# Altium schematic sheet Battery_Guage.SchDoc
size B; SheetNumber: 1; SheetTotal: 1
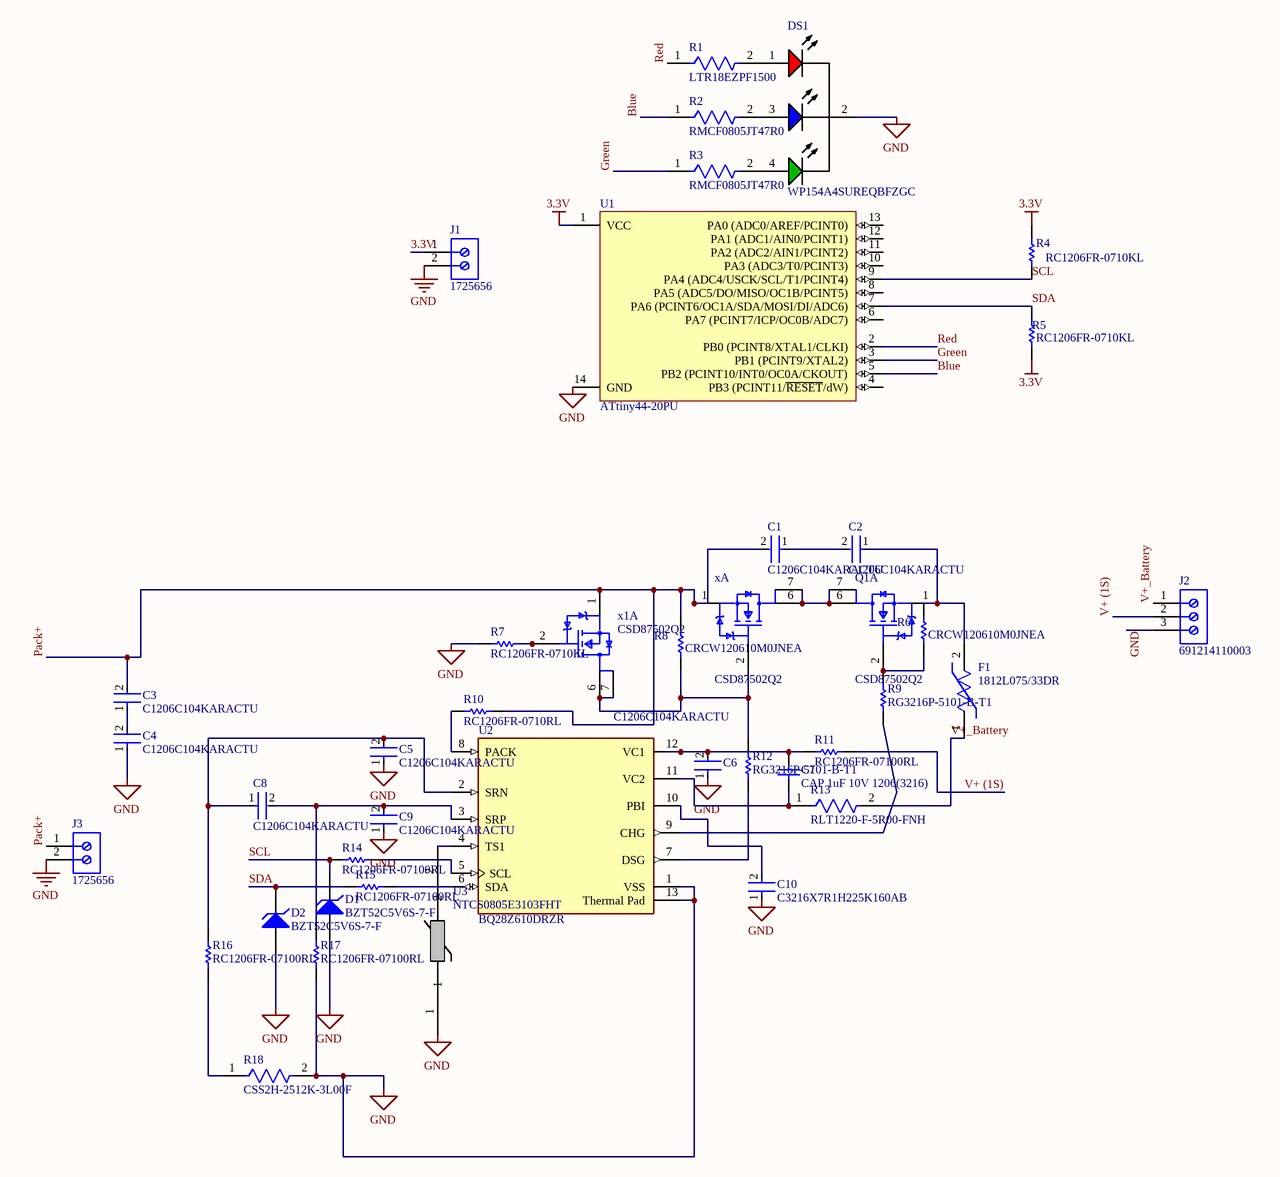
[diagram p0: Battery_Guage.SchDoc]

## Parts
C1  C1206C104KARACTU  [FP-C1206C-EB-MFG]
C2  C1206C104KARACTU  [FP-C1206C-EB-MFG]
C3  C1206C104KARACTU  [FP-C1206C-EB-MFG]
C4  C1206C104KARACTU  [FP-C1206C-EB-MFG]
C5  C1206C104KARACTU  [FP-C1206C-EB-MFG]
C6  C1206C104KARACTU  [FP-C1206C-EB-MFG]
C7  CAP 1uF 10V 1206(3216)  [CAPC1206(3216)130_L]
C8  C1206C104KARACTU  [FP-C1206C-EB-MFG]
C9  C1206C104KARACTU  [FP-C1206C-EB-MFG]
C10  C3216X7R1H225K160AB  [FP-C3216-160-0_2-IPC_A]
D1  BZT52C5V6S-7-F  [DIOD-SOD323-2_V]
D2  BZT52C5V6S-7-F  [DIOD-SOD323-2_V]
DS1  WP154A4SUREQBFZGC  [KING-WP154A4SUREQBFZGC_V]
F1  1812L075/33DR  [FP-1812L075-33DR-MFG]
J1  1725656  [PHOE-1725656-2]
J2  691214110003  [691214110003]
J3  1725656  [PHOE-1725656-2]
Q1  CSD87502Q2  [FP-DQK0006B-MFG]  (part A of 2)
R1  LTR18EZPF1500  [FP-LTR18-IPC_A]
R2  RMCF0805JT47R0  [FP-RMCF0805-MFG]
R3  RMCF0805JT47R0  [FP-RMCF0805-MFG]
R4  RC1206FR-0710KL  [RESC3116X65X40ML10T20]
R5  RC1206FR-0710KL  [RESC3116X65X40ML10T20]
R6  CRCW120610M0JNEA  [RESC3216X60X45LL10T20]
R7  RC1206FR-0710KL  [RESC3116X65X40ML10T20]
R8  CRCW120610M0JNEA  [RESC3216X60X45LL10T20]
R9  RG3216P-5101-B-T1  [RESC3216X50X50NL20T25]
R10  RC1206FR-0710RL  [RESC3116X65X40ML10T20]
R11  RC1206FR-07100RL  [RESC3116X65X40ML10T20]
R12  RG3216P-5101-B-T1  [RESC3216X50X50NL20T25]
R13  RLT1220-F-5R00-FNH  [FP-RLT1220-F-MFG]
R14  RC1206FR-07100RL  [RESC3116X65X40ML10T20]
R15  RC1206FR-07100RL  [RESC3116X65X40ML10T20]
R16  RC1206FR-07100RL  [RESC3116X65X40ML10T20]
R17  RC1206FR-07100RL  [RESC3116X65X40ML10T20]
R18  CSS2H-2512K-3L00F  [FP-CSS2H-2512K-3L00F-MFG]
U1  ATtiny44-20PU  [14P3]
U2  BQ28Z610DRZR  [FP-DRZ0012A-MFG]
U3  NTCS0805E3103FHT  [NTCS0805_VIS]
x  CSD87502Q2  [FP-DQK0006B-MFG]  (part A of 2)
x1  CSD87502Q2  [FP-DQK0006B-MFG]  (part A of 2)

## Nets
3.3V: J1.1 R4.2 R5.1 U1.1(VCC)
GND: C4.1 C5.1 C6.1 C9.1 C10.1 D1.1(A) D2.1(A) DS1.2(CATHODE) J1.2 J2.3 J3.2 R7.1 R17.1 R18.2 U1.14(GND) U2.1(VSS) U2.13(Thermal_Pad) U3.1
Blue: R2.1 U1.5(PB2_(PCINT10/INT0/OC0A/CKOUT))
Green: R3.1 U1.3(PB1_(PCINT9/XTAL2))
Pack+: C1.2 C3.2 J3.1 R8.2 R10.2 x.1(S1) x1.1(S1)
Red: R1.1 U1.2(PB0_(PCINT8/XTAL1/CLKI))
SCL: D1.2(K) R4.1 R14.1 U1.9(PA4_(ADC4/USCK/SCL/T1/PCINT4))
SDA: D2.2(K) R5.2 R15.1 U1.7(PA6_(PCINT6/OC1A/SDA/MOSI/DI/ADC6))
V+ (1S): J2.2 R11.1
V+_Battery: F1.1 J2.1 R13.2
NetC1_1: C1.1 C2.2
NetC2_1: C2.1 F1.2 Q1.1(S1) R6.2
NetC3_1: C3.1 C4.2
NetC5_2: C5.2 C8.1 R16.2 U2.2(SRN)
NetC6_2: C6.2 C7.2 R11.2 U2.12(VC1)
NetC7_1: C7.1 R13.1 U2.11(VC2)
NetC8_2: C8.2 C9.2 R17.2 U2.3(SRP)
NetC10_2: C10.2 U2.10(PBI)
NetDS1_1: DS1.1(RED) R1.2
NetDS1_3: DS1.3(BLUE) R2.2
NetDS1_4: DS1.4(GREEN) R3.2
NetQ1_2: Q1.2(G1) R6.1 R9.2
NetQ1_6: Q1.6(D1) Q1.7(D1) x.6(D1) x.7(D1)
NetR7_2: R7.2 x1.2(G1)
NetR8_1: R8.1 R12.2 x.2(G1) x1.6(D1) x1.7(D1)
NetR9_1: R9.1 U2.9(CHG)
NetR10_1: R10.1 U2.8(PACK)
NetR12_1: R12.1 U2.7(DSG)
NetR14_2: R14.2 U2.5(SCL)
NetR15_2: R15.2 U2.6(SDA)
NetR16_1: R16.1 R18.1
NetU2_4: U2.4(TS1) U3.2

Not connected (* = marked no-connect by the designer): U1 4(PB3_(PCINT11/~{RESET}/dW)) 6(PA7_(PCINT7/ICP/OC0B/ADC7)) 8(PA5_(ADC5/DO/MISO/OC1B/PCINT5)) 10(PA3_(ADC3/T0/PCINT3)) 11(PA2_(ADC2/AIN1/PCINT2)) 12(PA1_(ADC1/AIN0/PCINT1)) 13(PA0_(ADC0/AREF/PCINT0))

## Library data of the parts
C1-C6 C8 C9 = CMP-1037-04229-2: CAP CER 0.1UF 250V X7R 1206; Manufacturer: KEMET; Material: Ceramic; Temperature Coefficient: 15%; Value: 0.10 μF; Tolerance: 0.1; Automotive Grade: Grade 0; Mouser Description: Multilayer Ceramic Capacitors MLCC - SMD/SMT 250volts 0.1uF X7R 10%; Height: 0.88mm; Device Class L3: Ceramic Capacitors; Temperature Range Low: -55°C; Automotive: Yes; ComponentLink2Description: Datasheet; Category: Cap; RoHS: TRUE; Manufacturer Part Number: C1206C104KARACTU; Temperature Range High: +150°C; Package: C1206C-EB; Device Class L2: Capacitors; Voltage Rating: 250 V; Lead Free: Yes; Temperature Characteristic: X7R; Digikey Description: CAP CER 0.1UF 250V X7R 1206; ComponentLink2URL: https://content.kemet.com/datasheets/KEM_C1007_X8R_ULTRA_150C_SMD.pdf; Device Class L1: Passive Components; Ipc Land Pattern Name: CAPC320160X78; Temperature: -55°C to +150°C; Capacitance: 0.10 μF; Octopart: https://octopart.com/c1206c104karactu-kemet-193627
C7 = CMP-1037-04676-1: CAP 1uF 10V ±20% 1206 (3216 Metric) Thickness 1.3mm SMD; Tolerance: Â±20%; Case-Metric: 3216; Case-EIA: 1206; Value: 1uF; Technology: SMT; Rated Voltage: 10 V; Max Thickness: 1.3 mm
C10 = CMP-08246-002981-1: Multilayer Ceramic Capacitors 2.2uF ±10% 50V X7R SMD 1206; Case Code (Metric): 3216; Construction: Flat; Case/Package: 1206; Thickness: 0.075inch; Lead Free: Lead Free; Weight: 0.000571oz; Case Code (Imperial): 1206; Length: 3.2mm; Voltage Rating (DC): 50V; Termination: SMD/SMT; Width: 0.063inch; Packaging: Tape and Reel; Min Operating Temperature: -55°C; Mount: Surface Mount; Dielectric: X7R; RoHS Compliant: Yes; Capacitance: 2.2uF; Voltage Rating: 50V; Resistor Type: Ceramic; Tolerance: 10%; Series: C; Package Quantity: 1; Number of Pins: 2; Height: 1.6mm; Dielectric Material: Ceramic; Max Operating Temperature: 125°C; Depth: 1.6mm
D1 D2 = CMP-2000-05977-1: Surface Mount Zener Diode, 5.6 V, -65 to 150 degC, 2-Pin SOD323, RoHS, Tape and Reel; Manufacturer: DiodesIncorporated; Zener Current: 5mA; Vz - Zener Voltage: 5.6V; Pd - Power Dissipation: 200mW; Configuration: Single; Zz - Zener Impedance: 40Ohms; Ir - Reverse Current: 3uA; Unit Weight: 0.000173oz; Voltage Temperature Coefficient: 0.25mV/C; Voltage Tolerance: 5%; Datasheet Version: Rev. 18-2, 05/2012; Package Reference: SOD323-2; Minimum Operating Temperature: -65C; Packaging: Reel; Product Category: ZenerDiodes; Termination Style: SMD/SMT; Manufacturer URL: http://www.diodes.com/; Height: 1mm; Mounting Style: SMD/SMT; RoHS: True; Package / Case: SOD-323; Package Description: 2-Pin Surface Mount Device, Body 1.7 x 1.3 mm; Width: 1.4mm; Factory Pack Quantity: 3000; Brand: DiodesIncorporated; Mounting Technology: SurfaceMount; Maximum Operating Temperature: +150C; Length: 1.8mm; Package URL: http://www.vishay.com/docs/71192/71192.pdf; Datasheet URL: http://www.diodes.com/_files/datasheets/ds30093.pdf; Series: BZT52C5V6
DS1 = CMP-2000-07415-1: Full Color LED Lamp, Dominant Wavelength RGB 630 / 525 / 465 nm, -40 to 85 degC, 4-Pin THD, RoHS; Manufacturer: Kingbright; Viewing Angle: 50°; Wavelength - Dominant: 630nm,525nm,465nm; Online Catalog: 5mm,T-13/4(RGB)RoundwithDomedTopLEDLamp; Millicandela Rating: 1300mcdRed,1700mcdGreen,900mcdBlue; Other Names: 754-1615 / WP154A4SUREQBFZGC-ND; Current - Test: 20mA; Wavelength - Peak: 645nm,515nm,460nm; Color: Red,Green,Blue(RGB); Voltage - Forward (Vf) (Typ): 1.9VRed,3.3VGreen,3.3VBlue; Lens Type: Clear; 3D Model: WP154A4SUREQBFZGW.sldprt / WP154A4SUREQBFZGW.pro / WP154A4SUREQBFZGW.igs / WP154A4SUREQBFZGW.stp; Lens Style/Size: RoundwithDomedTop,5mm,T-13/4; Packaging: Bulk; Datasheet URL: https://www.kingbrightusa.com/images/catalog/spec/WP154A4SUREQBFZGC.pdf; Family: LEDIndication-Discrete; Datasheet Version: Rev. 5A, 08/2014; Category: Optoelectronics; Manufacturer URL: http://www.kingbright.com/; Height: 8.60mm; Mounting Type: ThroughHole; Package Reference: WP154A4SUREQBFZGC; Mounting Technology: ThroughHole; Package Description: 4-Pin Through Hole LED, Dia 5.9 mm, Pitch 1.27 mm; Standard Package: 500; Package / Case: Radial-4Leads
F1 = CMP-08606-000075-1: PTC RESET FUSE 33V 750MA 1812; Power Dissipation: 800mW; Time to Trip: 200ms; Approvals: TUV; Max Current Rating: 20A; Trip Current: 1.5A; Resistance: 400mR; Working Voltage: 33V; Min Operating Temperature: -40°C; Terminal Material: Copper; Case/Package: 1812; Case Code (Imperial): 1812; Termination: SMD/SMT; Lead Free: Lead Free; Mount: Surface Mount; Case Code (Metric): 4532; Package Quantity: 1500; Packaging: Tape and Reel; Voltage Rating: 33V; Operating Supply Voltage: 33V; Hold Current: 750mA; Height: 1.55mm; Width: 3.41mm; Series: 1812L; Length: 4.73mm; Max Power Dissipation: 800mW; Current Rating: 20A; Max Operating Temperature: 85°C; REACH SVHC: No SVHC; RoHS Compliant: Yes; Voltage Rating (DC): 33V
J1 J3 = CMP-2000-05299-1: Male Header, Pitch 2.54 mm, 1 x 2 Position, Height 9 mm, Tail Length 3.5 mm; Manufacturer: Phoenix Contact; Number of contacts: 2; Content: 250pc(s); Pitch: 2.54mm; Industrial packaging: Yes; Colour: Green; Manufacturer part No.: 1725656; Type: MPT0,5/2-2,54; Datasheet URL: http://datasheet.octopart.com/1725656-Phoenix-Contact-datasheet-5302866.pdf; Manufacturer URL: http://www.phoenixcontact.com/; Datasheet Version: Apr-08
J2 = CMP-1502-02466-2: NexarPartId: 18818289; Number of Levels: 1; Voltage: 300V; Pitch: 3.5052mm; Stripping Length: -6mm; Number of Positions Per Level: 3; Plating: Brass, Steel; Wire/Cable Gauge: 24AWG; Wire Gauge (Min): 16AWG; Current Rating: 10A; Width: 10.9mm; Length: 7.4mm; Housing Material: Nylon; Height: 12.2mm; Min Operating Temperature: -40°C; Contact Plating: Brass, Tin; Packaging: Box; Color: Blue, Green; Number of Contacts: 3; Number of Pins: 3; Voltage Rating: 300V; Termination: Screw; Lead Pitch: 3.5mm; Max Operating Temperature: 105°C; Mount: Through Hole; Contact Material: Brass; RoHS: Compliant; Wire Gauge (Max): 24AWG; Current: 10A; REACH SVHC: Unknown
Q1 x x1 = CMP-04962-000076-1: MOSFET 2N-CH 30V 5A 6WSON; Input Capacitance: 353pF; Max Power Dissipation: 2.3W; Rds On Max: 32.4mR; FET Type: 2 N-Channel; Element Configuration: Dual; Min Operating Temperature: -55°C; Lead Free: Lead Free; Max Operating Temperature: 150°C; Continuous Drain Current (ID): 5A; Packaging: Tape and Reel; Mount: Surface Mount; RoHS Compliant: Yes; Drain to Source Voltage (Vdss): 30V
R1 = CMP-08839-001220-1: High power chip resistors wide terminal type 150Ω 1% 0.75W 0612; Temperature Coefficient: 100ppm/°C; Max Power Dissipation: 750mW; Resistance: 150R; Max Operating Temperature: 155°C; Resistor Type: Thick Film; Case/Package: 1206; Packaging: Cut Tape; Case Code (Metric): 3216; Min Operating Temperature: -55°C; Number of Terminations: 2; Tolerance: 1%; Length: 0.063inch; Width: 0.126inch; Features: Automotive AEC-Q200; Series: LTR; Package Quantity: 1; Height: 0.026inch; Case Code (Imperial): 1206
R2 R3 = CMP-26527-000048-1: 47Ω ±5% 0.125W 0805 Thick Film Chip Resistor AEC-Q200 compliant; Power Rating: 125mW; Temperature Coefficient: 100ppm/°C; Resistance: 47R; Mount: Surface Mount; Case/Package: 0805; Length: 0.079inch; Min Operating Temperature: -55°C; Features: Automotive AEC-Q200; Max Power Dissipation: 125mW; Width: 0.049inch; Size Code: 0805; RoHS Compliant: Yes; Case Code (Imperial): 0805; Resistor Type: Thick Film; Packaging: Tape and Reel; Tolerance: 5%; Series: RMCF; Lead Free: Lead Free; Height: 0.026inch; Case Code (Metric): 2012; Max Operating Temperature: 155°C; Radiation Hardening: No; Contact Plating: Tin; Number of Terminations: 2
R4 R5 R7 = CMP-1014-00623-2: Chip Resistor, 10 KOhm, +/- 1%, 0.25 W, -55 to 155 degC, 1206 (3216 Metric), RoHS, Tape and Reel; Manufacturer: Yageo; Voltage Rating: 200V; Resistance: 10KOhm; Temperature Coefficient: 100ppm/degreesC; Power Rating: 250mW; Packaging: TapeandReel; Termination: SMD/SMT; REACH SVHC: Unknown; Tolerance: 1%; Height: 0.55mm; Composition: ThickFilm; Max Operating Temperature: 155degC; Datasheet Version: Rev. 5, 10/2016; Lead Free: LeadFree; Case Code (Metric): 3216; Depth: 1.6mm; Package Quantity: 5000; RoHSCompliant: true; Military Standard: Not; Case/Package: 1206; Case Code (Imperial): 1206; Min Operating Temperature: -55degC; Datasheet URL: http://www.yageo.com/NewPortal/yageodocoutput?fileName=/pdf/R-Chip/PYu-RC_Group_51_RoHS_L_5.pdf; Length: 3.1mm; Manufacturer URL: http://www.yageo.com/; Package Reference: 1206.0; Width: 1.6mm; Package Description: 2-Pin Surface Mount Device, Body 3.1 x 1.6 mm
R6 R8 = CMP-2003-04814-1: Manufacturer: Vishay Dale; Part Number: CRCW120610M0JNEA
R9 R12 = CMP-2003-02608-1: Manufacturer: Susumu; Part Number: RG3216P-5101-B-T1
R10 = CMP-2100-03677-1: Chip Resistor, 10 Ohm, +/- 1%, 0.25 W, -55 to 155 degC, 1206 (3216 Metric), RoHS, Tape and Reel; Manufacturer: Yageo; Voltage Rating (DC): 200V; Resistance: 10Ohm; Power Rating: 250mW; Temperature Coefficient: 200ppm/degreesC; Military Standard: Not; Package Description: 2-Pin Surface Mount Device, Body 3.1 x 1.6 mm; Packaging: TapeandReel; Datasheet Version: Rev. 5, 10/2016; Length: 3.1mm; Manufacturer URL: http://www.yageo.com/; Voltage Rating: 200V; Height: 0.026inch; REACH SVHC: Unknown; Max Operating Temperature: 155degC; Case Code (Imperial): 1206; Package Reference: 1206.0; RoHSCompliant: true; Termination: SMD/SMT; Lead Free: LeadFree; Composition: ThickFilm; Tolerance: 1%; Package Quantity: 1; Min Operating Temperature: -55degC; Datasheet URL: http://www.yageo.com/NewPortal/yageodocoutput?fileName=/pdf/R-Chip/PYu-RC_Group_51_RoHS_L_5.pdf; Number of Pins: 2; Width: 0.063inch; Case Code (Metric): 3216; Max Power Dissipation: 250mW; Depth: 1.6mm; Number of Terminations: 2; Case/Package: 1206
R11 R14-R17 = CMP-2100-03675-1: Chip Resistor, 100 Ohm, +/- 1%, 0.25 W, -55 to 155 degC, 1206 (3216 Metric), RoHS, Tape and Reel; Manufacturer: Yageo; Voltage Rating: 200V; Power Rating: 250mW; Resistance: 100Ohm; Temperature Coefficient: 100ppm/degreesC; Case Code (Imperial): 1206; Datasheet Version: Rev. 5, 10/2016; Case Code (Metric): 3216; Packaging: TapeandReel; Composition: ThickFilm; Height: 0.55mm; Lead Free: LeadFree; Depth: 1.6mm; Package Reference: 1206.0; Termination: SMD/SMT; Case/Package: 1206; Package Quantity: 5000; Datasheet URL: http://www.yageo.com/NewPortal/yageodocoutput?fileName=/pdf/R-Chip/PYu-RC_Group_51_RoHS_L_5.pdf; REACH SVHC: Unknown; Max Operating Temperature: 155degC; Length: 3.1mm; Manufacturer URL: http://www.yageo.com/; Min Operating Temperature: -55degC; Tolerance: 1%; RoHSCompliant: true; Width: 1.6mm; Package Description: 2-Pin Surface Mount Device, Body 3.1 x 1.6 mm
R13 = CMP-89038-000005-1: RES SMD 5 OHM 1% 1/3W 0805
R18 = CMP-00059-73869591-1: CSS2H-2512K-3L00F Res Metal Strip 2512 0.003 Ohm 1% 4W ±75ppm/C Pad SMD Automotive T/R; Resistance: 3mΩ; Temperature Coefficient: 50ppm/°C; Number of Terminations: 2; Height: 508µm; Width: 3.048mm; REACH SVHC: No SVHC; Length: 6.35mm; Packaging: Cut Tape; Composition: Metal Element, Metal Strip; Power Rating: 4W; Case Code (Imperial): 2512; Features: Moisture Resistant; Max Operating Temperature: 170°C; Max Power Dissipation: 4W; RoHS: Compliant; NexarPartId: 73869591; Case Code (Metric): 6432; Schedule B: 8533210045, 8533210045; Case/Package: 2512; Tolerance: 1%; Min Operating Temperature: -55°C
U1 = CMP-0093-00041-2: 8-bit AVR Microcontroller, 20MHz, 2.7-5.5V, 4KB Flash, 256 Bytes EEPROM, 256 Bytes SRAM, 14-pin PDIP, Industrial Grade (-40°C to 85°C), Pb-Free; ComponentLink3Description: ATtiny24/44/84 Summary; RevisionNote: DatasheetVersion updated. Removed ComponentAvailability note. URLs added.; ComponentLink1URL: http://www.atmel.com/; DatasheetVersion: revK, Oct-2010; PackageReference: 14P3; ComponentLink3URL: http://www.atmel.com/dyn/resources/prod_documents/8006S.pdf; ComponentLink2Description: ATtiny24/44/84 Datasheet; PackageDescription: 14-Lead Plastic Dual In-Line, 300 mil/7.62 mm Wide Body (PDIP); Code_JEDEC: MS-001-AA; ComponentLink2URL: http://www.atmel.com/dyn/resources/prod_documents/doc8006.pdf; PackageVersion: revB, Oct-2010; ComponentLink1Description: Manufacturer URL
U2 = CMP-04911-000059-1: IC BATT GAS GAUGE LIION 12SON; Interface: I2C; Operating Supply Voltage: 26V; Fault Protection: Over Current; Lead Free: Lead Free; Mount: Surface Mount; Max Operating Temperature: 85°C; Packaging: Tape and Reel; Min Operating Temperature: -40°C; Number of Pins: 12; RoHS Compliant: Yes
U3 = CMP-02404-000008-2: THERMISTOR NTC 10KOHM 3940K 0805; NexarPartId: 23920625; Power Rating: 210mW; Resistance: 10kΩ; Accuracy: 1%; Schedule B: 8533400080, 8533400080; Mount: Surface Mount; Packaging: Tape and Reel; Length: 2mm; Min Operating Temperature: -40°C; RoHS: Compliant; Depth: 1.25mm; Height: 950µm; Number of Pins: 2; Case/Package: 0805; Max Operating Temperature: 150°C; Radiation Hardening: No; Tolerance: 1%